# Altium schematic sheet DriverBoard_Driver.SchDoc
size 420 x 297 mm; DocumentNumber: Введите номер платы + Э3; SheetNumber: номер страницы; Format: A3
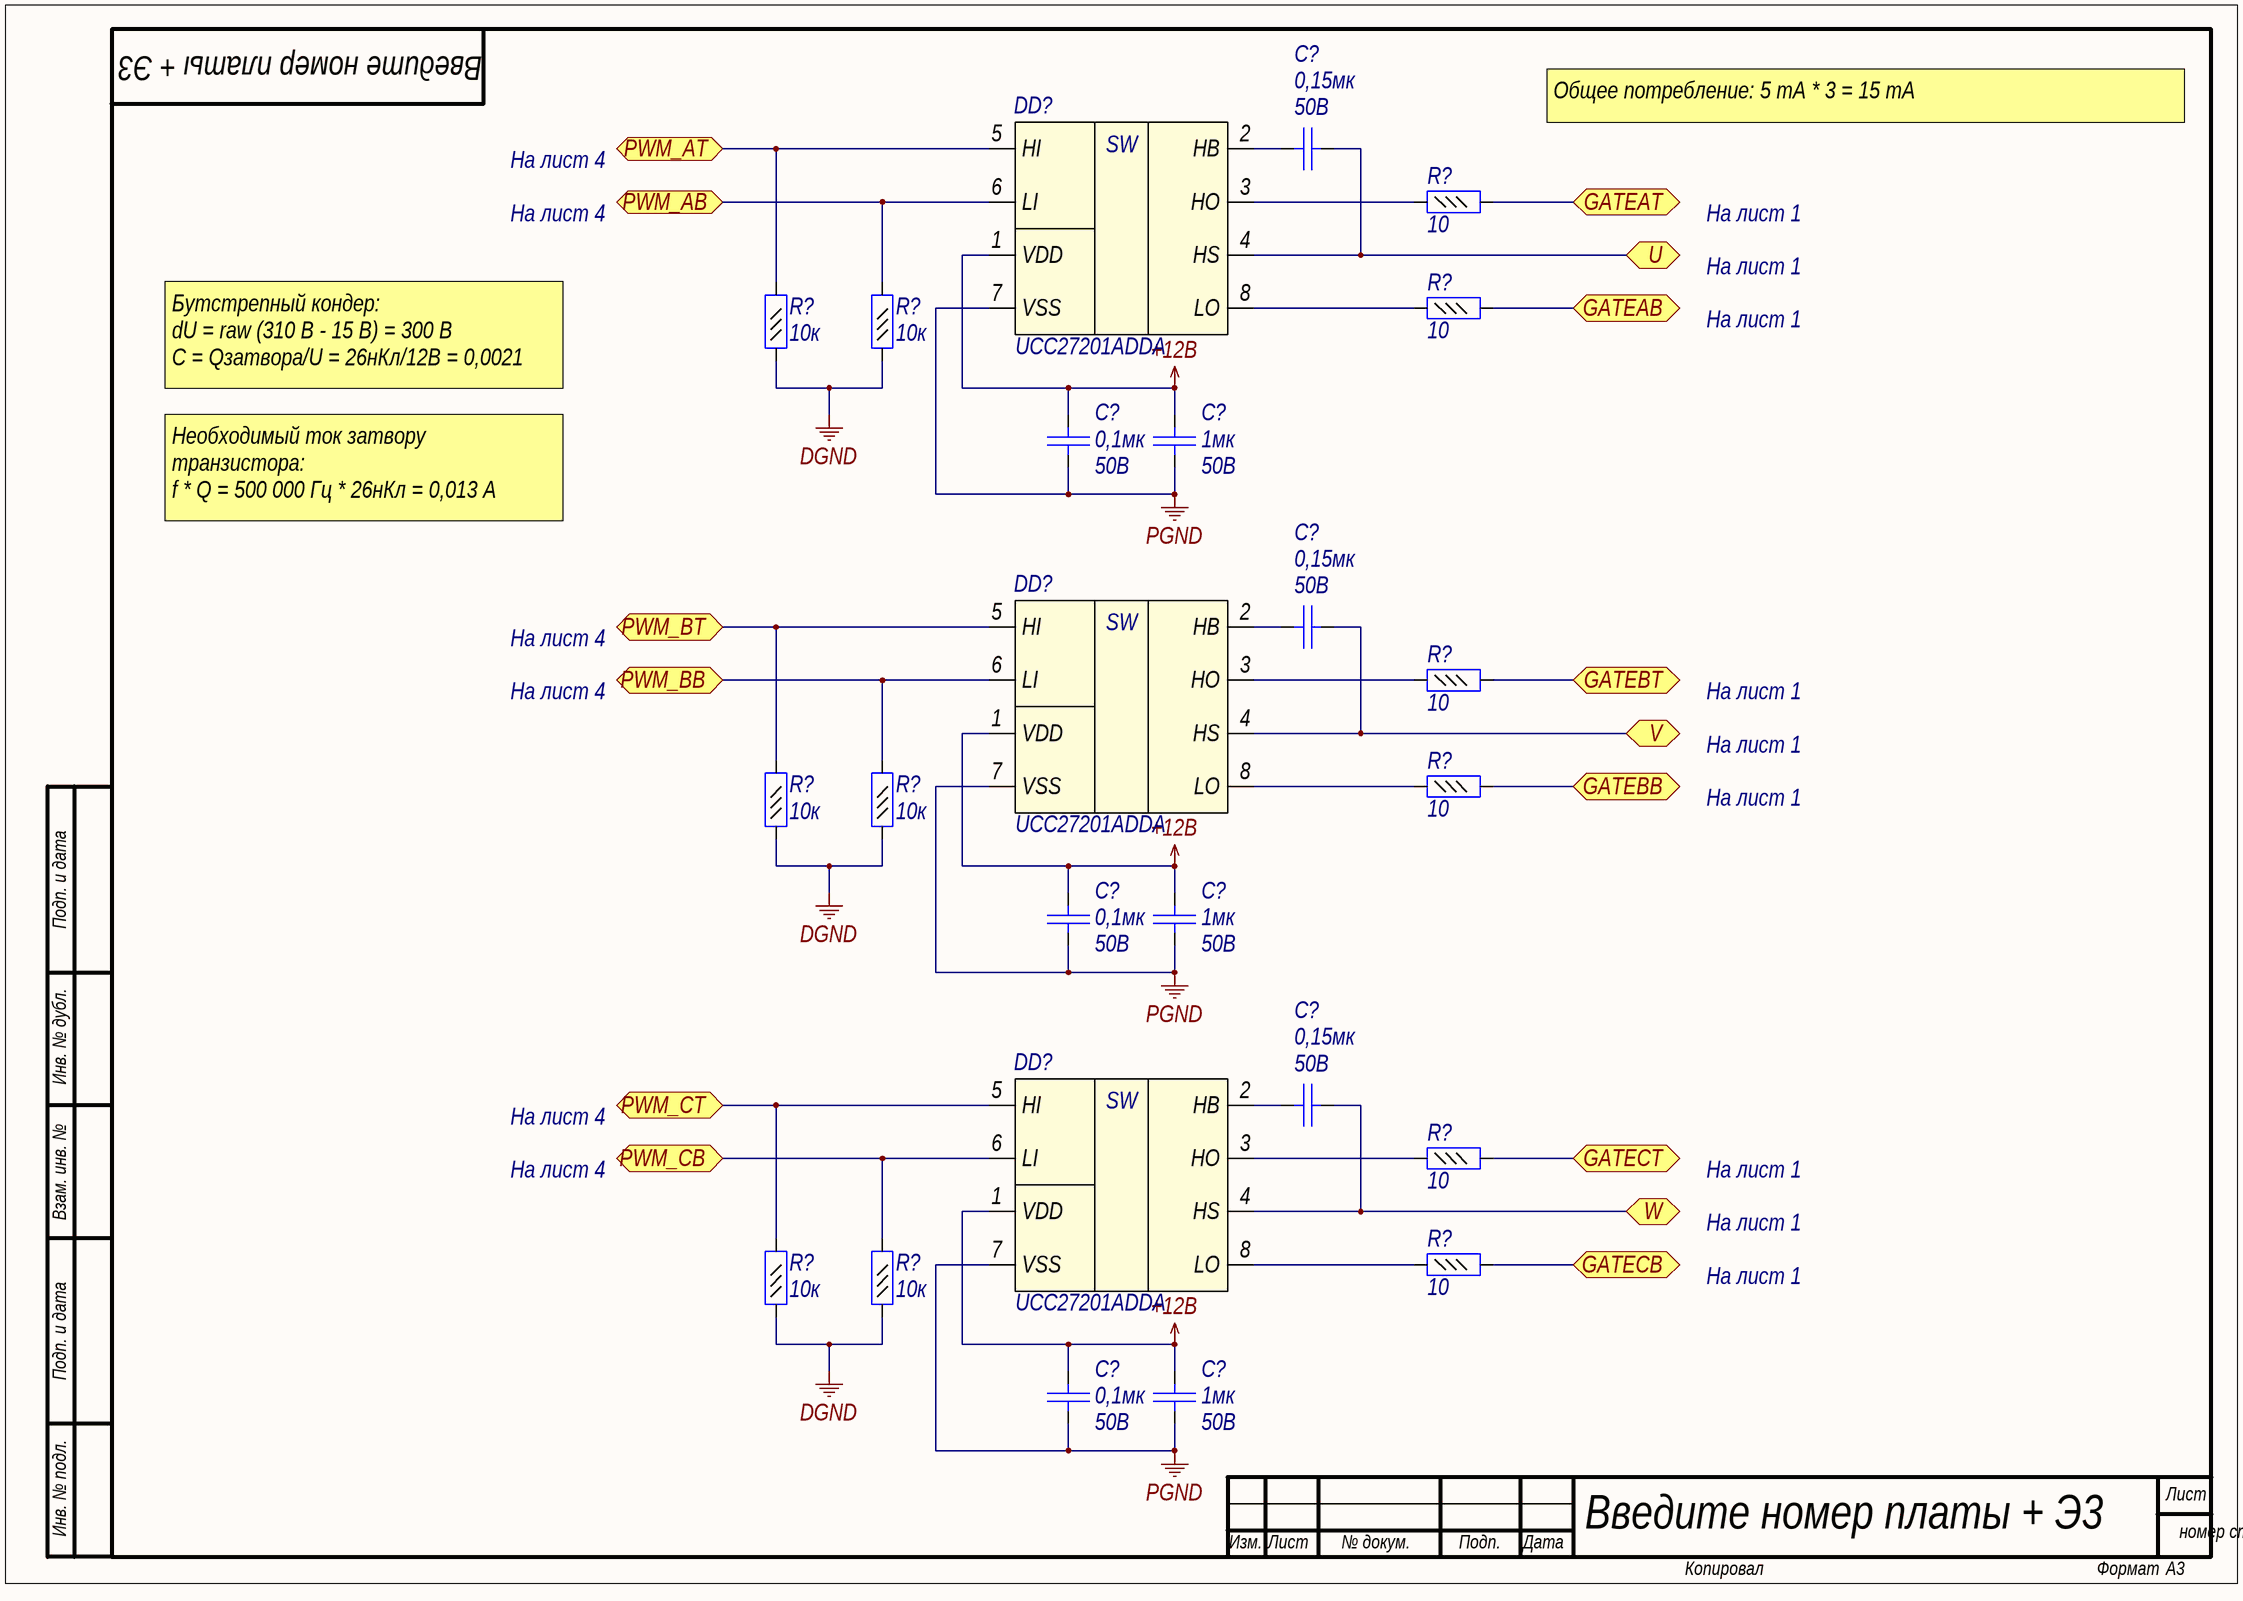
[diagram p0: DriverBoard_Driver.SchDoc]

## Parts
(Parts that share a designator on the sheet are numbered #1, #2 ... from top to bottom, then left to right.)
C?#1  value 0,15мк  Voltage: 50B  [C0603]  (hidden comment: Capacitor)
C?#2  value 0,1мк  Voltage: 50В  [C0402]  (hidden comment: Capacitor)
C?#3  value 1мк  Voltage: 50B  [C0805]  (hidden comment: Capacitor)
C?#4  value 0,15мк  Voltage: 50B  [C0603]  (hidden comment: Capacitor)
C?#5  value 0,1мк  Voltage: 50В  [C0402]  (hidden comment: Capacitor)
C?#6  value 1мк  Voltage: 50B  [C0805]  (hidden comment: Capacitor)
C?#7  value 0,15мк  Voltage: 50B  [C0603]  (hidden comment: Capacitor)
C?#8  value 0,1мк  Voltage: 50В  [C0402]  (hidden comment: Capacitor)
C?#9  value 1мк  Voltage: 50B  [C0805]  (hidden comment: Capacitor)
DD?#1  Part Number: UCC27201ADDA  [HSOP8]  (hidden comment: UCC27201A)
DD?#2  Part Number: UCC27201ADDA  [HSOP8]  (hidden comment: UCC27201A)
DD?#3  Part Number: UCC27201ADDA  [HSOP8]  (hidden comment: UCC27201A)
R?#1  value 10  [R0402]  (hidden comment: Resistor_0,062Вт)
R?#2  value 10  [R0402]  (hidden comment: Resistor_0,062Вт)
R?#3  value 10к  [R0402]  (hidden comment: Resistor_0,062Вт)
R?#4  value 10к  [R0402]  (hidden comment: Resistor_0,062Вт)
R?#5  value 10  [R0402]  (hidden comment: Resistor_0,062Вт)
R?#6  value 10  [R0402]  (hidden comment: Resistor_0,062Вт)
R?#7  value 10к  [R0402]  (hidden comment: Resistor_0,062Вт)
R?#8  value 10к  [R0402]  (hidden comment: Resistor_0,062Вт)
R?#9  value 10  [R0402]  (hidden comment: Resistor_0,062Вт)
R?#10  value 10  [R0402]  (hidden comment: Resistor_0,062Вт)
R?#11  value 10к  [R0402]  (hidden comment: Resistor_0,062Вт)
R?#12  value 10к  [R0402]  (hidden comment: Resistor_0,062Вт)

## Ports
GATEAB, GATEAT, GATEBB, GATEBT, GATECB, GATECT, PWM_AB, PWM_AT, PWM_BB, PWM_BT, PWM_CB, PWM_CT, U, V, W

## Nets
+12B: C?#2.2 C?#3.2 C?#5.2 C?#6.2 C?#8.2 C?#9.2 DD?#1.1(VDD) DD?#2.1(VDD) DD?#3.1(VDD)
DGND: R?#3.1 R?#4.1 R?#7.1 R?#8.1 R?#11.1 R?#12.1
PGND: C?#2.1 C?#3.1 C?#5.1 C?#6.1 C?#8.1 C?#9.1 DD?#1.7(VSS) DD?#2.7(VSS) DD?#3.7(VSS)
GATEAB: R?#2.2 ; port GATEAB
GATEAT: R?#1.2 ; port GATEAT
GATEBB: R?#6.2 ; port GATEBB
GATEBT: R?#5.2 ; port GATEBT
GATECB: R?#10.2 ; port GATECB
GATECT: R?#9.2 ; port GATECT
PWM_AB: DD?#1.6(LI) R?#4.2 ; port PWM_AB
PWM_AT: DD?#1.5(HI) R?#3.2 ; port PWM_AT
PWM_BB: DD?#2.6(LI) R?#8.2 ; port PWM_BB
PWM_BT: DD?#2.5(HI) R?#7.2 ; port PWM_BT
PWM_CB: DD?#3.6(LI) R?#12.2 ; port PWM_CB
PWM_CT: DD?#3.5(HI) R?#11.2 ; port PWM_CT
U: C?#1.2 DD?#1.4(HS) ; port U
V: C?#4.2 DD?#2.4(HS) ; port V
W: C?#7.2 DD?#3.4(HS) ; port W
NetC?#1_1: C?#1.1 DD?#1.2(HB)
NetC?#4_1: C?#4.1 DD?#2.2(HB)
NetC?#7_1: C?#7.1 DD?#3.2(HB)
NetDD?#1_3: DD?#1.3(HO) R?#1.1
NetDD?#1_8: DD?#1.8(LO) R?#2.1
NetDD?#2_3: DD?#2.3(HO) R?#5.1
NetDD?#2_8: DD?#2.8(LO) R?#6.1
NetDD?#3_3: DD?#3.3(HO) R?#9.1
NetDD?#3_8: DD?#3.8(LO) R?#10.1

## Notes on the sheet
- Общее потребление: 5 mA * 3 = 15 mA
- На лист 4
- На лист 1
- Бутстрепный кондер:
  dU = raw (310 B - 15 B) = 300 B
  C = Qзатвора/U = 26нКл/12В = 0,0021 мкФ
- Необходимый ток затвору транзистора:
  f * Q = 500 000 Гц * 26нКл = 0,013 А
  Ток на затвор = 12В / 10 ом = 1,2 А
- Подп. и дата
- Инв. № дубл.
- Взам. инв. №
- Инв. № подл.
- Лист
- Изм.
- № докум.
- Подп.
- Дата
- Копировал
- Формат
- (in symbol driver25) SW

## Library data of the parts
C?#1 C?#4 C?#7 = cap132: Конденсатор; Part Name: Ceramic; Manufacture: Samsung Electro-Mechanics; Part Number: CL10B154KB8VPNC; id: cap132; TKE: X7R
C?#2 C?#5 C?#8 = cap277: Конденсатор; Part Name: Ceramic; Manufacture: Murata; Part Number: GRM155R71H104KE14D; id: cap277; TKE: X7R; tga: 0,10%
C?#3 C?#6 C?#9 = cap151: Конденсатор; Part Name: Ceramic; Manufacture: Murata; Part Number: GRM21BR71H105K; id: cap151; TKE: X7R
DD?#1-DD?#3 = driver25: 120-V Boot, 3-A Peak, High-Frequency, High-Side and Low-Side Driver; Part Name: High-Side/Low-Side Driver; Manufacture: Texas Instruments; Logic High: 1,6B-2,5B; Logic Low: 0,8B-1,6B; Min Operating Supply Voltage: 8B; Max Operating Supply Voltage: 17B; Vbus: 120B; “A” OUTPUT: Noninverting; Maximum output current: 3A; Maximum Power Dissipation: 2,7W; id: driver25; “B” OUTPUT: Noninverting
R?#1 R?#2 R?#5 R?#6 R?#9 R?#10 = res222: Резистор; Manufacture: Yageo; Part Number: RC0402FR-0710RL; id: res222; Accuracy: 0,01; Part Name: Resistor; Power: 0,062Вт
R?#3 R?#4 R?#7 R?#8 R?#11 R?#12 = res294: Резистор; Manufacture: Yageo; Part Number: RC0402FR-0710KL; id: res294; Accuracy: 0,01; Part Name: Resistor; Power: 0,062Вт